# Altium schematic sheet EMIRemover.SchDoc
size A3; SheetNumber: 1; SheetTotal: 1
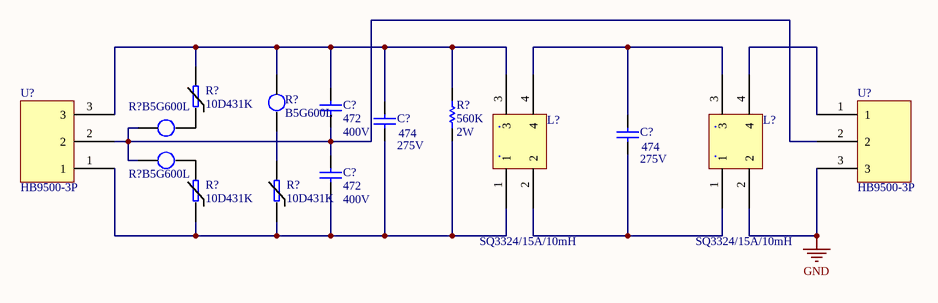
[diagram p0: EMIRemover.SchDoc]

## Parts
(Parts that share a designator on the sheet are numbered #1, #2 ... from top to bottom, then left to right.)
C?#1  400V  value 472  [RAD-0.4-BBC]
C?#2  275V  value 474  [RAD-0.4-BBC]
C?#3  275V  value 474  [RAD-0.4-BBC]
C?#4  400V  value 472  [RAD-0.4-BBC]
L?#1  SQ3324/15A/10mH
L?#2  SQ3324/15A/10mH
R?#1  10D431K
R?#2  B5G600L
R?#3  2W  value 560K  [AXIAL-0.3]
R?#4  B5G600L
R?#5  B5G600L
R?#6  10D431K
R?#7  10D431K
U?#1  HB9500-3P
U?#2  HB9500-3P

## Nets
GND: L?#2.2 U?#2.3
NetC?#1_1: C?#1.1 C?#2.1 L?#1.3 R?#1.1 R?#2.1 R?#3.1 U?#1.3
NetC?#1_2: C?#1.2 C?#4.1 R?#4.1 R?#5.1 U?#1.2 U?#2.2
NetC?#2_2: C?#2.2 C?#4.2 L?#1.1 R?#3.2 R?#6.2 R?#7.2 U?#1.1
NetC?#3_1: C?#3.1 L?#1.4 L?#2.3
NetC?#3_2: C?#3.2 L?#1.2 L?#2.1
NetL?#2_4: L?#2.4 U?#2.1
NetR?#1_2: R?#1.2 R?#4.2
NetR?#2_2: R?#2.2 R?#7.1
NetR?#5_2: R?#5.2 R?#6.1

## Library data of the parts
C?#1-C?#4 = Cap: Capacitor; Published: 8-Jun-2000; LatestRevisionDate: 17-Jul-2002; LatestRevisionNote: Re-released for DXP Platform.; PackageReference: RAD-0.3; Publisher: Altium Limited; PackageDescription: Radial Cap, Thru-Hole; 2 Leads; 0.3 in Pin Spacing
L?#1 L?#2 = SQ3324
R?#3 = Res1: Resistor; Published: 8-Jun-2000; LatestRevisionDate: 17-Jul-2002; LatestRevisionNote: Re-released for DXP Platform.; PackageReference: AXIAL-0.3; Publisher: Altium Limited; PackageDescription: Axial Device, Thru-Hole; 2 Leads; 0.3 in Pin Spacing